# EAGLE schematic esp32Layout1 (EAGLE 9.6.2)
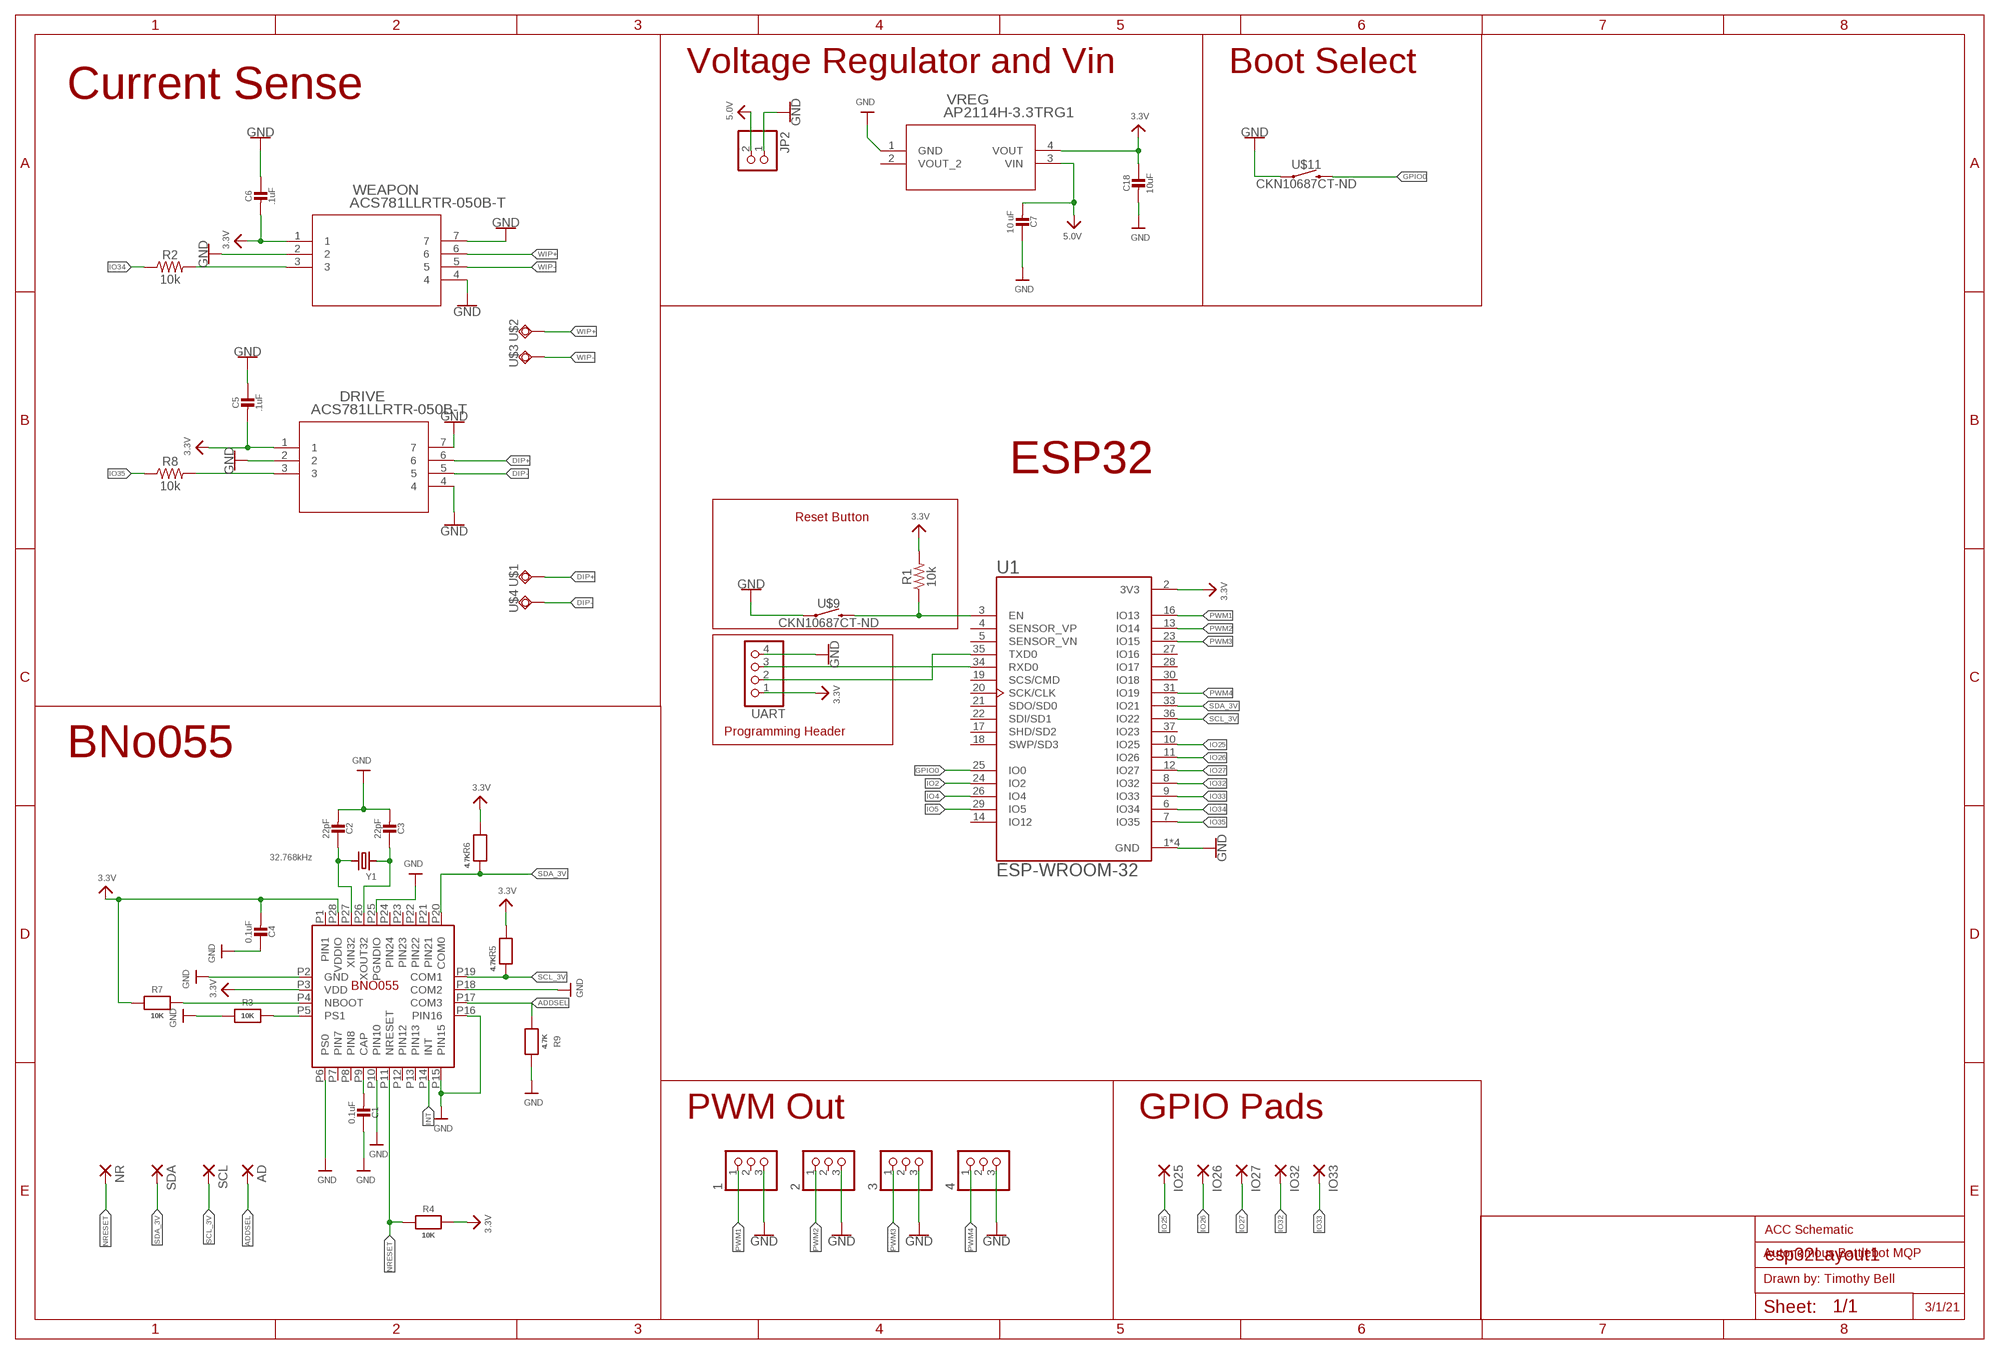
[diagram p0: schematic, sheet 1]

## Parts
1  PINHD-1X3  [1X03]
2  PINHD-1X3  [1X03]
3  PINHD-1X3  [1X03]
4  PINHD-1X3  [1X03]
AD  SMD2  [SMD1,27-2,54]
BNO055  BNO055  [BNO055]
C1  0.1uF  CAP_CERAMIC0805-NOOUTLINE  [0805-NO]
C2  22pF  CAP_CERAMIC0805-NOOUTLINE  [0805-NO]
C3  22pF  CAP_CERAMIC0805-NOOUTLINE  [0805-NO]
C4  0.1uF  CAP_CERAMIC0805-NOOUTLINE  [0805-NO]
C5  .1uF  CAP_CERAMIC0805_10MGAP  [0805_10MGAP]
C6  .1uF  CAP_CERAMIC0805_10MGAP  [0805_10MGAP]
C7  10 uF  CAP_CERAMIC0805-NOOUTLINE  [0805-NO]
C18  10uF  CAP_CERAMIC0805_10MGAP  [0805_10MGAP]
DRIVE  ACS781LLRTR-050B-T  [PSOF7_ACS781LLRTR-050B-T_ALM]
IO25  SMD2  [SMD1,27-2,54]
IO26  SMD2  [SMD1,27-2,54]
IO27  SMD2  [SMD1,27-2,54]
IO32  SMD2  [SMD1,27-2,54]
IO33  SMD2  [SMD1,27-2,54]
JP2  PINHD-1X2  [1X02]
NR  SMD2  [SMD1,27-2,54]
R1  10k  10KOHM-0603-1/10W-1%  [0603]
R2  10k  10KOHM-0603-1/10W-1%  [0603]
R3  10K  RESISTOR0805_NOOUTLINE  [0805-NO]
R4  10K  RESISTOR0805_NOOUTLINE  [0805-NO]
R5  4.7K  RESISTOR0805_NOOUTLINE  [0805-NO]
R6  4.7K  RESISTOR0805_NOOUTLINE  [0805-NO]
R7  10K  RESISTOR0805_NOOUTLINE  [0805-NO]
R8  10k  10KOHM-0603-1/10W-1%  [0603]
R9  4.7K  RESISTOR0805_NOOUTLINE  [0805-NO]
SCL  SMD2  [SMD1,27-2,54]
SDA  SMD2  [SMD1,27-2,54]
U1  ESP-WROOM-32  [MODULE_ESP-WROOM-32]
U$1  HCURR_PAD  [HCURR_PAD]
U$2  HCURR_PAD  [HCURR_PAD]
U$3  HCURR_PAD  [HCURR_PAD]
U$4  HCURR_PAD  [HCURR_PAD]
U$9  CKN10687CT-ND  [CKN10687CT-ND]
U$11  CKN10687CT-ND  [CKN10687CT-ND]
UART  PINHD-1X4  [1X04]
VREG  AP2114H-3.3TRG1  [SOT-223_DIO]
WEAPON  ACS781LLRTR-050B-T  [PSOF7_ACS781LLRTR-050B-T_ALM]
Y1  32.768kHz  CRYSTAL8.0X3.8  [CRYSTAL_8X3.8]

## Nets
3.3V: BNO055.P3(VDD) BNO055.P28(VDDIO) C4.2 C5.2 C6.2 C18.1 DRIVE.1 R1.2 R4.2 R5.2 R6.2 R7.1 U1.2(3V3) UART.1 VREG.4(VOUT) WEAPON.1
5.0V: C7.2 JP2.2 VREG.3(VIN)
ADDSEL: AD.1(P) BNO055.P17(COM3) R9.1
DIP+: DRIVE.6 U$1.P$1(TP)
DIP-: DRIVE.5 U$4.P$1(TP)
GND [New Class]: 1.3 2.3 3.3 4.3 BNO055.P2(GND) BNO055.P6(PS0) BNO055.P10(PIN10) BNO055.P15(PIN15) BNO055.P16(PIN16) BNO055.P18(COM2) BNO055.P25(PGNDIO) C1.1 C2.2 C3.2 C4.1 C5.1 C6.1 C7.1 C18.2 DRIVE.2 DRIVE.4 DRIVE.7 JP2.1 R3.1 R9.2 U1.1(GND) U1.1.1(GND) U1.15(GND) U1.38(GND) U$9.P$1 U$9.P$2 U$11.P$1 U$11.P$2 UART.4 VREG.1(GND) WEAPON.2 WEAPON.4 WEAPON.7
GPIO0: U1.25(IO0) U$11.P$3 U$11.P$4
INT: BNO055.P14(INT)
IO2: U1.24(IO2)
IO4: U1.26(IO4)
IO5: U1.29(IO5)
IO25: IO25.1(P) U1.10(IO25)
IO26: IO26.1(P) U1.11(IO26)
IO27: IO27.1(P) U1.12(IO27)
IO32: IO32.1(P) U1.8(IO32)
IO33: IO33.1(P) U1.9(IO33)
IO34: R2.1 U1.6(IO34)
IO35: R8.1 U1.7(IO35)
N$1: BNO055.P5(PS1) R3.2
N$2 [New Class]: R1.1 U1.3(EN) U$9.P$3 U$9.P$4
N$3 [New Class]: U1.35(TXD0) UART.2
N$4 [New Class]: U1.34(RXD0) UART.3
N$5: R2.2 WEAPON.3
N$6: BNO055.P9(CAP) C1.2
N$7: BNO055.P27(XIN32) C2.1 Y1.P$4
N$8: BNO055.P26(XOUT32) C3.1 Y1.P$1
N$9: BNO055.P4(NBOOT) R7.2
N$10: DRIVE.3 R8.2
NRESET [New Class]: BNO055.P11(NRESET) NR.1(P) R4.1
PWM1: 1.1 U1.16(IO13)
PWM2: 2.1 U1.13(IO14)
PWM3: 3.1 U1.23(IO15)
PWM4: 4.1 U1.31(IO19)
SCL_3V: BNO055.P19(COM1) R5.1 SCL.1(P) U1.36(IO22)
SDA_3V: BNO055.P20(COM0) R6.1 SDA.1(P) U1.33(IO21)
WIP+: U$2.P$1(TP) WEAPON.6
WIP-: U$3.P$1(TP) WEAPON.5
Unconnected: 1.2 2.2 3.2 4.2 BNO055.P1(PIN1) BNO055.P7(PIN7) BNO055.P8(PIN8) BNO055.P12(PIN12) BNO055.P13(PIN13) BNO055.P21(PIN21) BNO055.P22(PIN22) BNO055.P23(PIN23) BNO055.P24(PIN24) U1.4(SENSOR_VP) U1.5(SENSOR_VN) U1.14(IO12) U1.17(SHD/SD2) U1.18(SWP/SD3) U1.19(SCS/CMD) U1.20(SCK/CLK) U1.21(SDO/SD0) U1.22(SDI/SD1) U1.27(IO16) U1.28(IO17) U1.30(IO18) U1.37(IO23) VREG.2(VOUT_2)

## Notes on the sheet
- Voltage Regulator and Vin | Boot Select
- Current Sense
- ESP32
- Reset Button
- Programming Header
- BNo055
- PWM Out | GPIO Pads
- ACC Schematic
- Autonomous Battlebot MQP
- Drawn by: Timothy Bell
- 3/1/21

## Library data of the parts
1-4 = pinhead:PINHD-1X3: PIN HEADER
AD IO25-IO27 IO32 IO33 NR SCL SDA = wirepad:SMD2: SMD PAD
BNO055 = Tim Parts:BNO055
C1-C7 C18 = microbuilder:CAP_CERAMIC: Ceramic Capacitors For new designs, use the packages preceded by an '_' character since they are more reliable: The following footprints should be used on most boards: _0402 - Standard footprint for regular board layouts _0603 - Standard footprint for regular board layouts _0805 - Standard footprint for regular board layouts _1206 - Standard footprint for regular board layouts For extremely tight-pitch boards where space is at a premium, the following 'micro-pitch' footprints can be used (smaller pads, no silkscreen outline, etc.): _0402MP - Micro-pitch footprint for very dense/compact boards _0603MP - Micro-pitch footprint for very dense/compact boards _0805MP - Micro-pitch footprint for very dense/compact boards _1206MP - Micro-pitch footprint for very dense/compact boards
DRIVE WEAPON = Bell Parts:ACS781LLRTR-050B-T; BUILT_BY: EMA_Kyle; COPYRIGHT: Copyright (C) 2018 Accelerated Designs. All rights reserved; MANUFACTURER_PART_NUMBER: ACS781LLRTR-050B-T; SOURCELIBRARY: Allegro_Microsystems_Inc_2020-02-13; VENDOR: Allegro Microsystems Inc.
JP2 = pinhead:PINHD-1X2: PIN HEADER
R1 R2 R8 = SparkFun-Resistors:10KOHM: 10kΩ resistor A resistor is a passive two-terminal electrical component that implements electrical resistance as a circuit element. Resistors act to reduce current flow, and, at the same time, act to lower voltage levels within circuits. - Wikipedia; PROD_ID: RES-00824
R3-R7 R9 = microbuilder:RESISTOR: Resistors For new designs, use the packages preceded by an '_' character since they are more reliable: The following footprints should be used on most boards: _0402 - Standard footprint for regular board layouts _0603 - Standard footprint for regular board layouts _0805 - Standard footprint for regular board layouts _1206 - Standard footprint for regular board layouts For extremely tight-pitch boards where space is at a premium, the following 'micro-pitch' footprints can be used (smaller pads, no silkscreen outline, etc.): _0402MP - Micro-pitch footprint for very dense/compact boards _0603MP - Micro-pitch footprint for very dense/compact boards _0805MP - Micro-pitch footprint for very dense/compact boards _1206MP - Micro-pitch footprint for very dense/compact boards
U1 = ESP-WROOM-32:ESP-WROOM-32: Module: combo; GPIO, I2C x2, I2S x2, SDIO, SPI x3, UART x3; 19.5dBm Check prices <https://pricing.snapeda.com/parts/ESP-WROOM-32/Olimex%20LTD/view-part?ref=eda>; AVAILABILITY: Bad; DESCRIPTION: WiFi 802.11b/g/n/d/e/i Transceiver Module 2.4GHz Surface Mount; MF: Olimex LTD; MP: ESP-WROOM-32; PACKAGE: Module Olimex LTD; PRICE: None
U$1-U$4 = Bell Parts:HCURR_PAD
U$9 U$11 = Bell Parts:CKN10687CT-ND
UART = pinhead:PINHD-1X4: PIN HEADER
VREG = Bell Parts:AP2114H-3.3TRG1; BUILT_BY: EMA_UL_Team; MANUFACTURER_PART_NUMBER: AP2114H-3.3TRG1; SOURCELIBRARY: DIODESINC_2_2015-08-18; VENDOR: Diodes Inc
Y1 = microbuilder:CRYSTAL: Crystals HC49UP - Surface Mount Crystal 4.0MHz 18pF +/-30ppm Surface Mount Crystal [Digikey: 535-9857-1-ND] 12.0 MHz Surface Mount Crystal [Digikey: 535-9869-6-ND] 25.0 MHz Surface Mount Crystal [Digikey: 535-9078-1-ND] 2.5 x 2.0mm - MEMs SMT Crystal 16.0 MHz 10pF 20ppm 2.5 x 2.0mm Crystal [Digikey -40-85°C: 535-10923-1-ND] 3.2 x 2.5mm - MEMs SMT Crystal 12.0 MHz 8pF 15ppm 3.2 x 2.5mm Crystal [Digikey: -10-70°C: 644-1047-1-ND -40-125°C: 644-1128-1-ND] 40~85°C cheaper: 644-1173-6-ND 16.0 MHz 8pF 15ppm 3.2 x 2.5mm Crystal [Digikey: -10-70°C: 644-1049-1-ND -40-125°C: 644-1129-2-ND]-40~85°C cheaper: 644-1175-6-ND 16.0 MHz 10pF 10ppm 3.2 x 2.5mm Crystal [Digikey: 644-1100-1-ND] 27.12 MHz 18pF 30ppm 3.2 x 2.5mm Crystal [Digikey: 887-1424-1-ND] 27.12MHz 10pF 10ppm 3.2 x 2.5mm Crystal [Digikey: 887-1329-1-ND] 4.9 x 1.8mm - MEMs SMT Crystal 32.768 KHz 12.5pF 20ppm 4.9 x 1.8mm Crystal [Digikey: SE2415CT-ND] 8.0 x 3.8mm - Surface Mount Crystal 32.768kHz 12.5pF 20ppm -40°C-85°C [Digikey: 535-9166-2-ND] Cylinder 32.768KHz Cylinder Crystal (2x6mm body) [Ex. Digikey: 300-8341-2-ND]

## Net classes
1 New Class: width 0.152 mm, drill 0.254 mm, clearance 0.254 mm